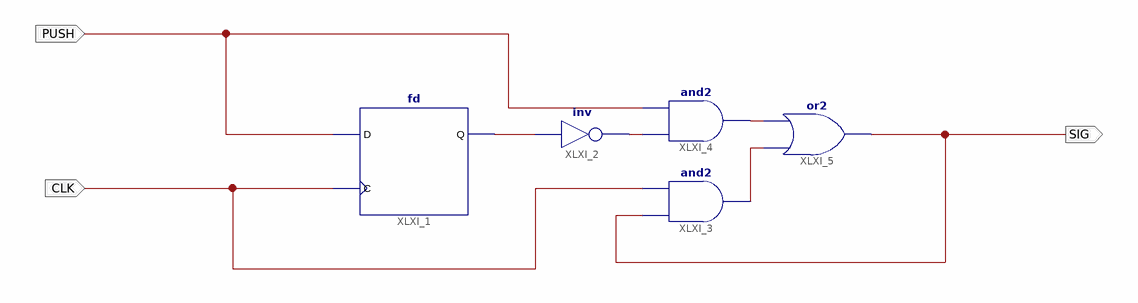
[diagram p0: schematic sheet 1]
// Xilinx ISE schematic clk_signal_sch.sch (spartan3e) as structural Verilog: 5 symbols, 3 ports
module clk_signal_sch (
  input  PUSH,
  input  CLK,
  output SIG
);

  wire XLXN_3, XLXN_4, XLXN_5, XLXN_6;

  fd XLXI_1 (.C(CLK), .D(PUSH), .Q(XLXN_3));
  not XLXI_2 (XLXN_4, XLXN_3);
  and XLXI_4 (XLXN_5, XLXN_4, PUSH);
  or XLXI_5 (SIG, XLXN_6, XLXN_5);
  and XLXI_3 (XLXN_6, SIG, CLK);
endmodule
